# Altium schematic sheet 原理图1.SchDoc
size A3
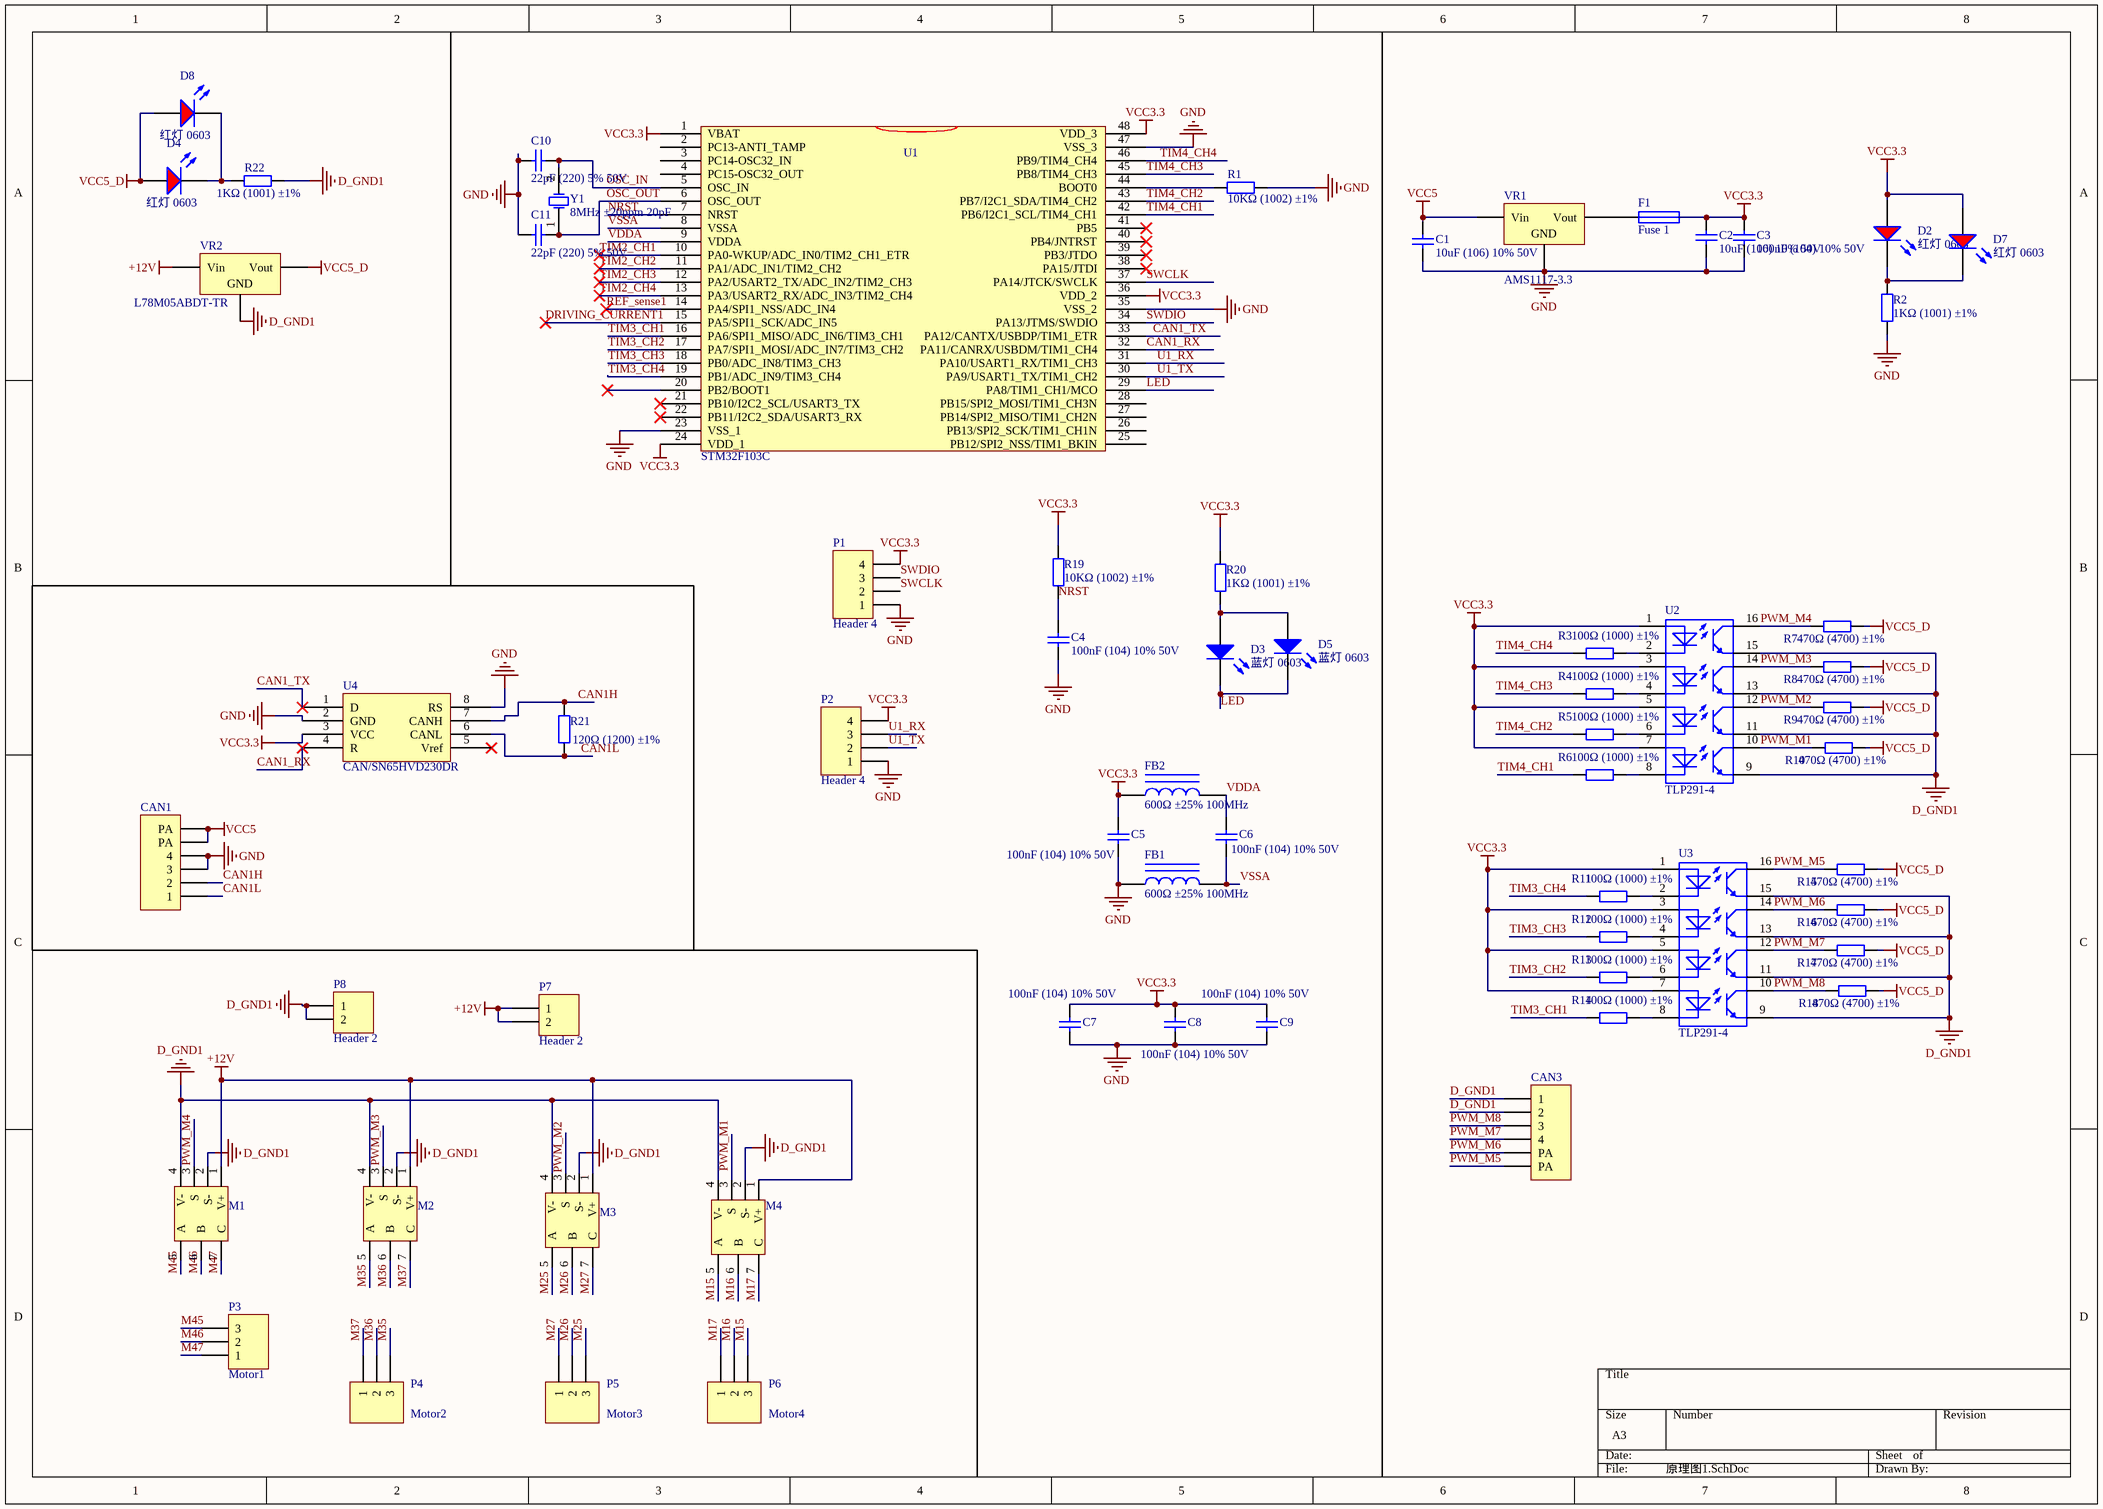
[diagram p0: 原理图1.SchDoc]

## Parts
C1  10uF (106) 10% 50V  [0603_C]
C2  10uF (106) 10% 50V  [0603_C]
C3  100nF (104) 10% 50V  [0603_C]
C4  100nF (104) 10% 50V  [0603_C]
C5  100nF (104) 10% 50V  [0603_C]
C6  100nF (104) 10% 50V  [0603_C]
C7  100nF (104) 10% 50V  [0603_C]
C8  100nF (104) 10% 50V  [0603_C]
C9  100nF (104) 10% 50V  [0603_C]
C10  22pF (220) 5% 50V  [0603_C]
C11  22pF (220) 5% 50V  [0603_C]
CAN1  Header 6  [Modolex_6P]  (value not drawn)
CAN3  Header 6  [Modolex_6P]  (value not drawn)
D2  红灯 0603  [0603_LED_S1]
D3  蓝灯 0603  [0603_LED_S1]
D4  红灯 0603  [0603_LED_S1]
D5  蓝灯 0603  [0603_LED_S1]
D7  红灯 0603  [0603_LED_S1]
D8  红灯 0603  [0603_LED_S1]
F1  Fuse 1  [6-0805_M]
FB1  600Ω ±25% 100MHz  [0603_L]
FB2  600Ω ±25% 100MHz  [0603_L]
M1  HOBBYWING_FPV  [HOBBYWING_WING20A/30A]  (value not drawn)
M2  HOBBYWING_FPV  [HOBBYWING_WING20A/30A]  (value not drawn)
M3  HOBBYWING_FPV  [HOBBYWING_WING20A/30A]  (value not drawn)
M4  (no value)  [HOBBYWING_WING20A/30A]
P1  Header 4  [Molex-4]
P2  Header 4  [Molex-4]
P3  Motor1  [1]
P4  Motor2  [1]
P5  Motor3  [1]
P6  Motor4  [1]
P7  Header 2  [XT30 - 2]
P8  Header 2  [XT30 - 2]
R1  10KΩ (1002) ±1%  [0603_R]
R2  1KΩ (1001) ±1%  [0603_R]
R3  100Ω (1000) ±1%  [0603_R]
R4  100Ω (1000) ±1%  [0603_R]
R5  100Ω (1000) ±1%  [0603_R]
R6  100Ω (1000) ±1%  [0603_R]
R7  470Ω (4700) ±1%  [0603_R]
R8  470Ω (4700) ±1%  [0603_R]
R9  470Ω (4700) ±1%  [0603_R]
R10  470Ω (4700) ±1%  [0603_R]
R11  100Ω (1000) ±1%  [0603_R]
R12  100Ω (1000) ±1%  [0603_R]
R13  100Ω (1000) ±1%  [0603_R]
R14  100Ω (1000) ±1%  [0603_R]
R15  470Ω (4700) ±1%  [0603_R]
R16  470Ω (4700) ±1%  [0603_R]
R17  470Ω (4700) ±1%  [0603_R]
R18  470Ω (4700) ±1%  [0603_R]
R19  10KΩ (1002) ±1%  [0603_R]
R20  1KΩ (1001) ±1%  [0603_R]
R21  120Ω (1200) ±1%  [0603_R]
R22  1KΩ (1001) ±1%  [0603_R]
U1  STM32F103C  [LQFP-48_7x7x05P]
U2  TLP291-4  [LC-SOP-16_150mil]
U3  TLP291-4  [LC-SOP-16_150mil]
U4  CAN/SN65HVD230DR  [SOIC-8_150mil]
VR1  AMS1117-3.3  [SOT-223]
VR2  L78M05ABDT-TR  [TO-252-2-180]
Y1  8MHz ±20ppm 20pF  [SMD-5032_2P]

## Nets
+12V: M1.1(V+) M2.1(V+) M3.1(V+) M4.1(V+) P7.1 P7.2 VR2.1(Vin)
D_GND1: CAN3.1 CAN3.2 M1.2(S-) M1.4(V-) M2.2(S-) M2.4(V-) M3.2(S-) M3.4(V-) M4.2(S-) M4.4(V-) P8.1 P8.2 R22.1 U2.9 U2.11 U2.13 U2.15 U3.9 U3.11 U3.13 U3.15 VR2.2(GND)
GND: C1.1 C2.1 C3.1 C4.1 C5.1 C7.1 C8.1 C9.1 C10.1 C11.1 CAN1.3 CAN1.4 FB1.1 P1.1 P2.1 R1.1 R2.1 U1.23(VSS_1) U1.35(VSS_2) U1.47(VSS_3) U4.2(GND) U4.8(RS) VR1.1(GND)
VCC3.3: C2.2 C3.2 C5.2 C7.2 C8.2 C9.2 D2.A D7.A F1.2 FB2.1 P1.4 P2.4 R19.2 R20.2 U1.1(VBAT) U1.24(VDD_1) U1.36(VDD_2) U1.48(VDD_3) U2.1 U2.3 U2.5 U2.7 U3.1 U3.3 U3.5 U3.7 U4.3(VCC)
VCC5: C1.2 CAN1.5(PA) CAN1.6(PA) VR1.3(Vin)
VCC5_D: D4.A D8.A R7.2 R8.2 R9.2 R10.2 R15.2 R16.2 R17.2 R18.2 VR2.3(Vout)
CAN1_RX: U1.32(PA11/CANRX/USBDM/TIM1_CH4) U4.4(R)
CAN1_TX: U1.33(PA12/CANTX/USBDP/TIM1_ETR) U4.1(D)
CAN1H: CAN1.2 R21.1 U4.7(CANH)
CAN1L: CAN1.1 R21.2 U4.6(CANL)
DRIVING_CURRENT1: U1.15(PA5/SPI1_SCK/ADC_IN5)
LED: D3.K D5.K U1.29(PA8/TIM1_CH1/MCO)
M15: M4.5(A) P6.3
M16: M4.6(B) P6.2
M17: M4.7(C) P6.1
M25: M3.5(A) P5.3
M26: M3.6(B) P5.2
M27: M3.7(C) P5.1
M35: M2.5(A) P4.3
M36: M2.6(B) P4.2
M37: M2.7(C) P4.1
M45: M1.5(A) P3.3
M46: M1.6(B) P3.2
M47: M1.7(C) P3.1
NRST: C4.2 R19.1 U1.7(NRST)
OSC_IN: C10.2 U1.5(OSC_IN) Y1.2(OSC2)
OSC_OUT: C11.2 U1.6(OSC_OUT) Y1.1(OSC1)
PWM_M1: M4.3(S) R10.1 U2.10
PWM_M2: M3.3(S) R9.1 U2.12
PWM_M3: M2.3(S) R8.1 U2.14
PWM_M4: M1.3(S) R7.1 U2.16
PWM_M5: CAN3.6(PA) R15.1 U3.16
PWM_M6: CAN3.5(PA) R16.1 U3.14
PWM_M7: CAN3.4 R17.1 U3.12
PWM_M8: CAN3.3 R18.1 U3.10
REF_sense1: U1.14(PA4/SPI1_NSS/ADC_IN4)
SWCLK: P1.2 U1.37(PA14/JTCK/SWCLK)
SWDIO: P1.3 U1.34(PA13/JTMS/SWDIO)
TIM2_CH1: U1.10(PA0-WKUP/ADC_IN0/TIM2_CH1_ETR)
TIM2_CH2: U1.11(PA1/ADC_IN1/TIM2_CH2)
TIM2_CH3: U1.12(PA2/USART2_TX/ADC_IN2/TIM2_CH3)
TIM2_CH4: U1.13(PA3/USART2_RX/ADC_IN3/TIM2_CH4)
TIM3_CH1: R14.1 U1.16(PA6/SPI1_MISO/ADC_IN6/TIM3_CH1)
TIM3_CH2: R13.1 U1.17(PA7/SPI1_MOSI/ADC_IN7/TIM3_CH2)
TIM3_CH3: R12.1 U1.18(PB0/ADC_IN8/TIM3_CH3)
TIM3_CH4: R11.1 U1.19(PB1/ADC_IN9/TIM3_CH4)
TIM4_CH1: R6.1 U1.42(PB6/I2C1_SCL/TIM4_CH1)
TIM4_CH2: R5.1 U1.43(PB7/I2C1_SDA/TIM4_CH2)
TIM4_CH3: R4.1 U1.45(PB8/TIM4_CH3)
TIM4_CH4: R3.1 U1.46(PB9/TIM4_CH4)
U1_RX: P2.3 U1.31(PA10/USART1_RX/TIM1_CH3)
U1_TX: P2.2 U1.30(PA9/USART1_TX/TIM1_CH2)
VDDA: C6.2 FB2.2 U1.9(VDDA)
VSSA: C6.1 FB1.2 U1.8(VSSA)
NetD2_K: D2.K D7.K R2.2
NetD3_A: D3.A D5.A R20.1
NetD4_K: D4.K D8.K R22.2
NetF1_1: F1.1 VR1.2(Vout)
NetR1_2: R1.2 U1.44(BOOT0)
NetR3_2: R3.2 U2.2
NetR4_2: R4.2 U2.4
NetR5_2: R5.2 U2.6
NetR6_2: R6.2 U2.8
NetR11_2: R11.2 U3.2
NetR12_2: R12.2 U3.4
NetR13_2: R13.2 U3.6
NetR14_2: R14.2 U3.8

Not connected (* = marked no-connect by the designer): U1 2(PC13-ANTI_TAMP) 3(PC14-OSC32_IN) 4(PC15-OSC32_OUT) 20(PB2/BOOT1)* 21(PB10/I2C2_SCL/USART3_TX)* 22(PB11/I2C2_SDA/USART3_RX)* 25(PB12/SPI2_NSS/TIM1_BKIN) 26(PB13/SPI2_SCK/TIM1_CH1N) 27(PB14/SPI2_MISO/TIM1_CH2N) 28(PB15/SPI2_MOSI/TIM1_CH3N) 38(PA15/JTDI)* 39(PB3/JTDO)* 40(PB4/JNTRST)* 41(PB5)*; U4 5(Vref)*

## Library data of the parts
C1 C2 = 1206 10uF (106) 10% 50V: 贴片电容; ComponentLink1Description: 供应商链接; ComponentLink1URL: http://www.szlcsc.com/product/details_14236.html; Package: 1206; Supplier: LC; SuppliersPartNumber: C13585
C3-C9 = 0603 100nF (104) 10% 50V: 贴片电容; ComponentLink1Description: 供应商链接; ComponentLink1URL: http://www.szlcsc.com/product/details_15331.html; Package: 0603; Supplier: LC; SuppliersPartNumber: C14663
C10 C11 = 0805 22pF (220) 5% 50V: 贴片电容; ComponentLink1Description: 供应商链接; ComponentLink1URL: http://www.szlcsc.com/product/details_2156.html; Package: 0805; Supplier: LC; SuppliersPartNumber: C1804
CAN1 CAN3 = Header 6: Header, 6-Pin; LatestRevisionDate: 17-Jul-2002; LatestRevisionNote: Re-released for DXP Platform.; Publisher: Altium Limited
D2 D4 D7 D8 = 0603 红灯: 发光二极管; ComponentLink1Description: 供应商链接; ComponentLink1URL: http://www.szlcsc.com/product/details_2659.html; Package: 0603; Supplier: LC; SuppliersPartNumber: C2286
D3 D5 = 0603 蓝灯: 发光二极管; ComponentLink1Description: 供应商链接; ComponentLink1URL: http://www.szlcsc.com/product/details_73150.html; Package: 0603; Supplier: LC; SuppliersPartNumber: C72041
F1 = Fuse 1: Fuse; Published: 8-Jun-2000; LatestRevisionDate: 17-Jul-2002; LatestRevisionNote: Re-released for DXP Platform.; PackageReference: PIN-W2/E2.8; Publisher: Altium Limited; PackageDescription: Thru-Hole; 2 Leads
FB1 FB2 = 0805 600Ω 25% 100MHz: 贴片磁珠; ComponentLink1Description: 供应商链接; ComponentLink1URL: http://www.szlcsc.com/product/details_1369.html; Package: 0805; Supplier: LC; SuppliersPartNumber: C1017
M4 = HOBBYWING_FPV
P1 P2 = Header 4: Header, 4-Pin; LatestRevisionDate: 17-Jul-2002; LatestRevisionNote: Re-released for DXP Platform.; Publisher: Altium Limited
P3-P6 = Header 3: Header, 3-Pin; LatestRevisionDate: 17-Jul-2002; LatestRevisionNote: Re-released for DXP Platform.; Publisher: Altium Limited
P7 P8 = Header 2: Header, 2-Pin; LatestRevisionDate: 17-Jul-2002; LatestRevisionNote: Re-released for DXP Platform.; Publisher: Altium Limited
R1 R19 = 0603 10KΩ (1002) 1%: 贴片电阻; ComponentLink1Description: 供应商链接; ComponentLink1URL: http://www.szlcsc.com/product/details_26547.html; Package: 0603; Supplier: LC; SuppliersPartNumber: C25804
R2 R20 R22 = 0603 1KΩ (1001) 1%: 贴片电阻; ComponentLink1Description: 供应商链接; ComponentLink1URL: http://www.szlcsc.com/product/details_21904.html; Package: 0603; Supplier: LC; SuppliersPartNumber: C21190
R3-R6 R11-R14 = 0603 100Ω (1000) 1%: 贴片电阻; ComponentLink1Description: 供应商链接; ComponentLink1URL: http://www.szlcsc.com/product/details_23502.html; Package: 0603; Supplier: LC; SuppliersPartNumber: C22775
R7-R10 R15-R18 = 0603 470Ω (4700) 1%: 贴片电阻; ComponentLink1Description: 供应商链接; ComponentLink1URL: http://www.szlcsc.com/product/details_23906.html; Package: 0603; Supplier: LC; SuppliersPartNumber: C23179
R21 = 0603 120Ω (1200) 1%: 贴片电阻; ComponentLink1Description: 供应商链接; ComponentLink1URL: http://www.szlcsc.com/product/details_23514.html; Package: 0603; Supplier: LC; SuppliersPartNumber: C22787
U2 U3 = TLP521-4
U4 = CAN/SN65HVD230DR_[C12084]: CAN; ComponentLink1Description: 供应商链接; ComponentLink1URL: http://www.szlcsc.com/product/details_12661.html; Package: SOIC-8_150mil; Supplier: LC; SuppliersPartNumber: C12084
VR1 = SOT-223 AMS1117-3.3: 低压差线性稳压(LDO); ComponentLink1Description: 供应商链接; ComponentLink1URL: http://www.szlcsc.com/product/details_6652.html; Package: SOT-223; Supplier: LC; SuppliersPartNumber: C6186
VR2 = TO-252-2 L78M05ABDT-TR: 低压差线性稳压(LDO); ComponentLink1Description: 供应商链接; ComponentLink1URL: http://www.szlcsc.com/product/details_59107.html; Package: TO-252-2; Supplier: LC; SuppliersPartNumber: C58069
Y1 = SMD-5032_2P 8MHz 20ppm 20pF: 贴片晶振; ComponentLink1Description: 供应商链接; ComponentLink1URL: http://www.szlcsc.com/product/details_117214.html; Package: SMD-5032_2P; Supplier: LC; SuppliersPartNumber: C115962